# EAGLE design uv-dosimeter-guva-op-amp-mk-1.1 (EAGLE 7.5.0)
AUTHOR: sean@yak.net
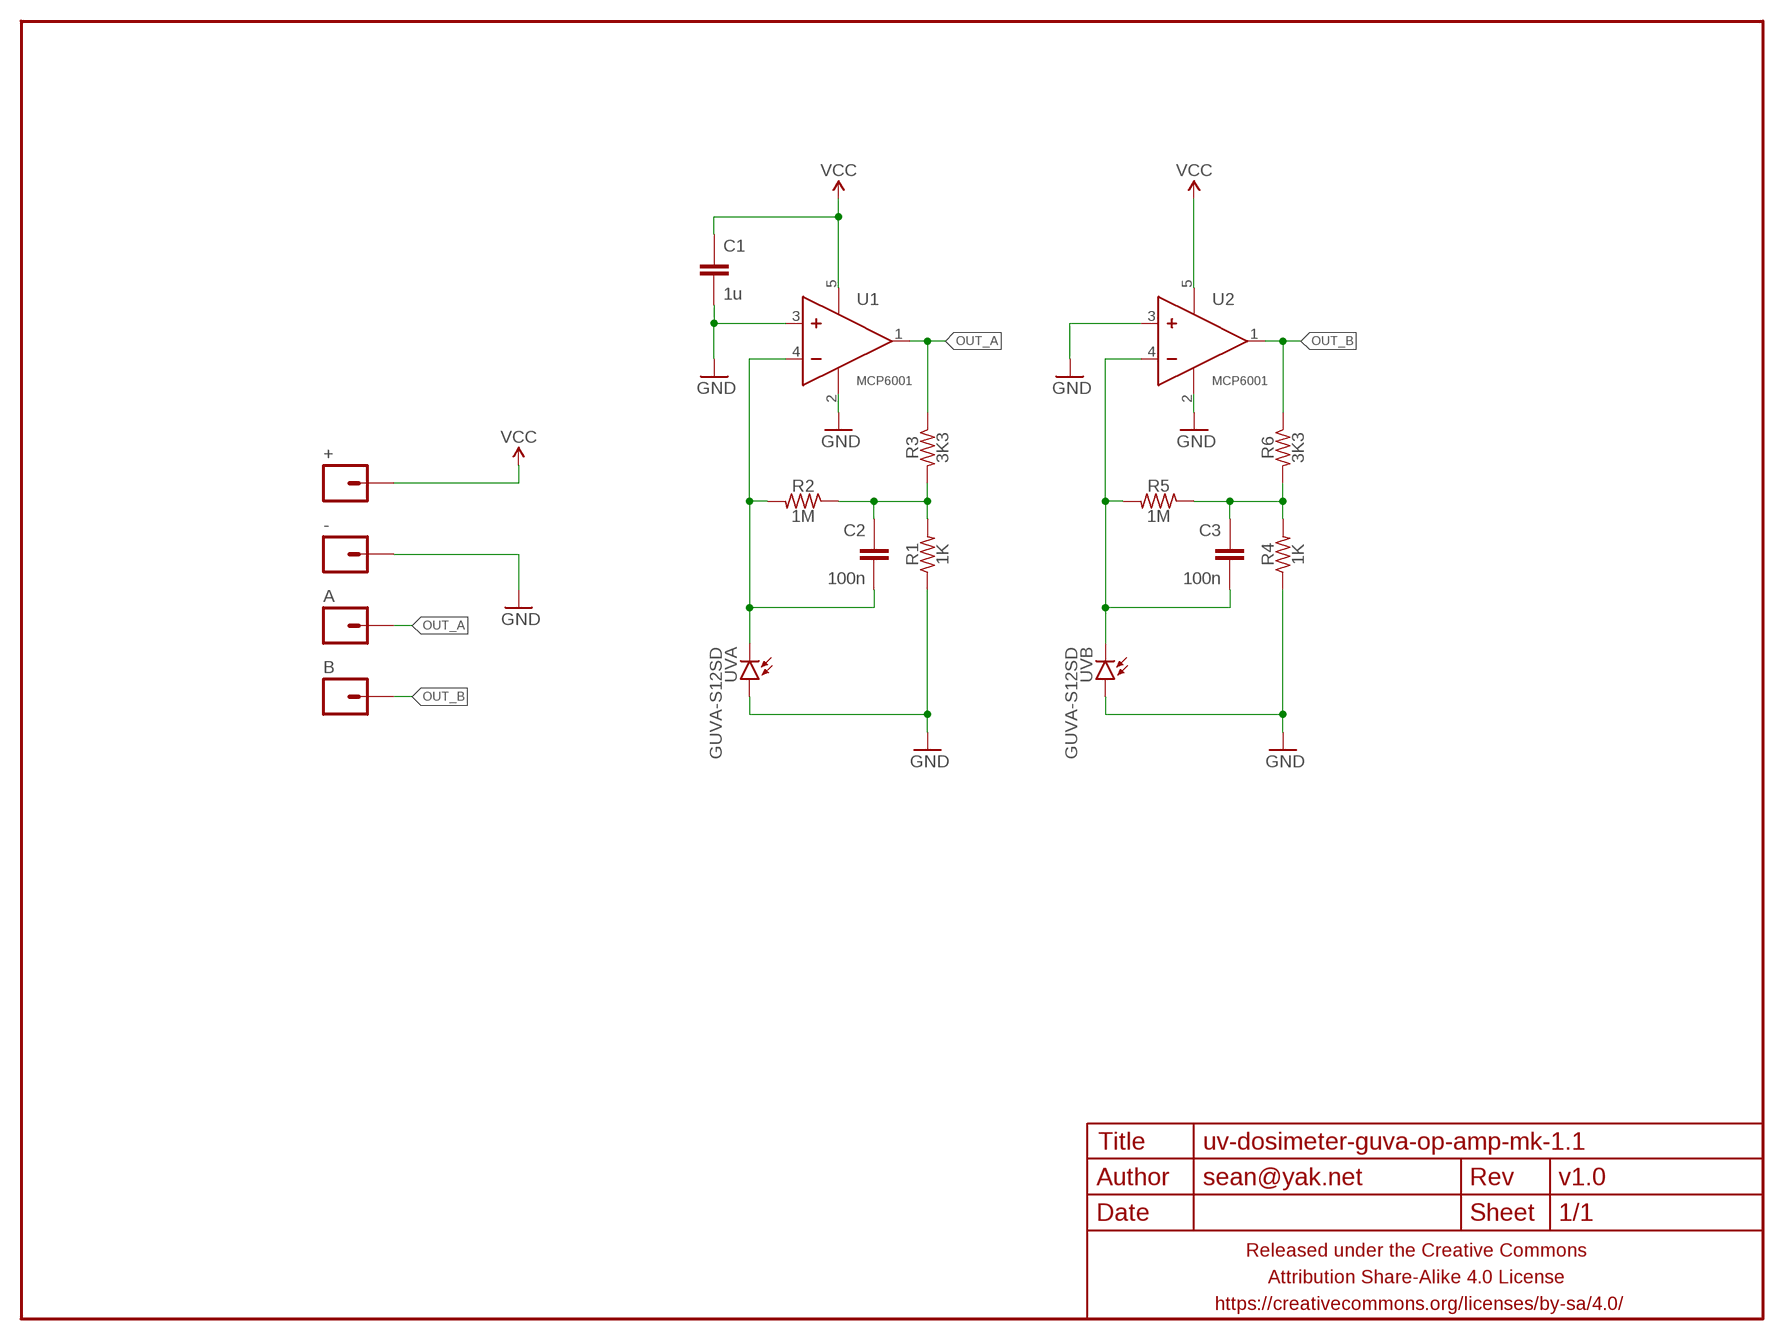
[diagram p0: schematic, sheet 1]

## Parts
+  M01PTH  [1X01]
-  M01PTH  [1X01]
A  M01PTH  [1X01]
B  M01PTH  [1X01]
C1  1u  CAPACITOR-CERAMICC0603  [C0603]
C2  100n  CAPACITOR-CERAMICC0603  [C0603]
C3  100n  CAPACITOR-CERAMICC0603  [C0603]
FRAME1  FRAME-LETTERNO_PACKAGE  [DUMMY]
R1  1K  RESISTORR0603  [R0603]
R2  1M  RESISTORR0603  [R0603]
R3  3K3  RESISTORR0603  [R0603]
R4  1K  RESISTORR0603  [R0603]
R5  1M  RESISTORR0603  [R0603]
R6  3K3  RESISTORR0603  [R0603]
U1  MCP6001  MCP6001SOT23-5  [SOT23-5]
U2  MCP6001  MCP6001SOT23-5  [SOT23-5]
UVA  GUVA-S12SD  GUVA-S12SDLED3528  [LED3528]
UVB  GUVA-S12SD  GUVA-S12SDLED3528  [LED3528]

## Nets
GND: -.1 C1.2 R1.1 R4.1 U1.2(V-) U1.3(IN+) U2.2(V-) U2.3(IN+) UVA.A UVB.A
N$2: C2.1 R1.2 R2.1 R3.2
N$4: C3.1 R4.2 R5.1 R6.2
NEG_FEED_A: C2.2 R2.2 U1.4(IN-) UVA.K(C)
NEG_FEED_B: C3.2 R5.2 U2.4(IN-) UVB.K(C)
OUT_A: A.1 R3.1 U1.1(OUT)
OUT_B: B.1 R6.1 U2.1(OUT)
VCC: +.1 C1.1 U1.5(V+) U2.5(V+)

## Library data of the parts
+ - A B = a_parts:M01: Header 1 Standard 1-pin 0.1" header. Use with straight break away headers (SKU : PRT-00116), right angle break away headers (PRT-00553), swiss pins (PRT-00743), machine pins (PRT-00117), and female headers (PRT-00115).
C1-C3 = a_parts:CAPACITOR-CERAMIC: CAPACITOR, European symbol
FRAME1 = A_butts:FRAME-LETTER: Schematic Frame Standard 8.5x11 US Letter frame; DESIGNER: sean@yak.net; VERSION: v1.0
R1-R6 = a_parts:RESISTOR: RESISTOR, American symbol
U1 U2 = a_parts:MCP6001
UVA UVB = a_parts:GUVA-S12SD

## Board
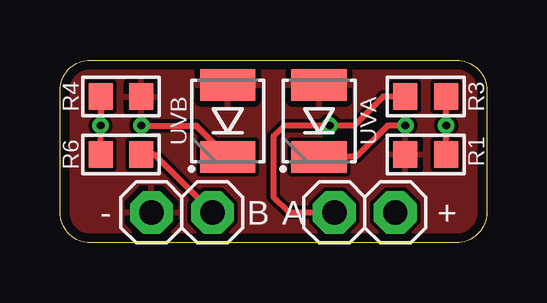
[diagram p1: board, top side]
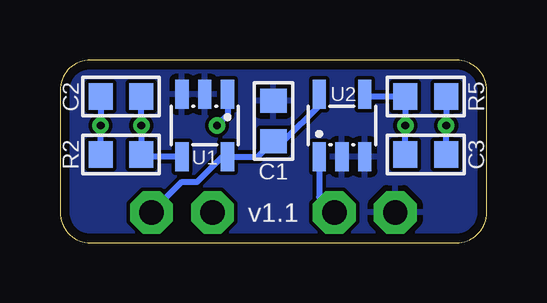
[diagram p2: board, bottom side, seen from below]

Size 17.78 x 7.62 mm. Coordinates in mm from the lower left corner, seen from the top.
Outline: 16.51,0 1.27,0 arc-90 0,1.27 0,6.35 arc-90 1.27,7.62 16.51,7.62 arc-90 17.78,6.35 17.78,1.27 arc-90 16.51,0
Copper layers (1*16): Top 0.0356mm / dielectric 1.5011mm / Bottom 0.0356mm
Design rules "LaenPCBOrder_2": minimum track width 6mil, minimum drill 13mil, track to track 6mil, track to pad 6mil, pad to pad 6mil, via to via 6mil, smd to smd 6mil, copper to edge 15mil, drill to drill 6mil, minimum pad ring 7mil, minimum via ring 7mil, stop-mask expansion 3mil, vias tented up to drill 20mil, thermal gap 10mil

### Footprints (pad centres in the part's own frame; a part is rotated, then mirrored left to right if it is on the bottom)
1X01 = drill 1.016 pad 1.778 octagon: 1 0,0
C0603 = smd 1 x 1.1: 1 -0.85,0; 2 0.85,0
R0603 = smd 1 x 1.1: 1 -0.85,0; 2 0.85,0
SOT23-5 = smd 0.55 x 1.2: 1 -0.95,-1.3; 2 0,-1.3; 3 0.95,-1.3; 4 0.95,1.3; 5 -0.95,1.3
LED3528 = smd 2.3 x 1.3: A 0,-1.5; K 0,1.5

### Placement (x,y rotation side)
+  13.97,1.27 0 top
-  3.81,1.27 0 top
A  11.43,1.27 0 top
B  6.35,1.27 0 top
C1  8.89,5.08 90 bottom
C2  15.24,6.1 0 bottom
C3  2.54,3.68 180 bottom
FRAME1  0,0 90 bottom
R1  15.24,3.68 0 top
R2  15.24,3.68 0 bottom
R3  15.24,6.1 0 top
R4  2.54,6.1 180 top
R5  2.54,6.1 180 bottom
R6  2.54,3.68 180 top
U1  11.75,4.89 180 bottom
U2  6.03,4.89 0 bottom
UVA  10.79,5.08 180 top
UVB  6.99,5.08 180 top

### Tracks (layer width: path | path; a pad name or v marks a point on that pad's centre or on a via)
GND
  pour Bottom (rank 6): 16.51,0 1.27,0 arc-90 0,1.27 0,6.35 arc-90 1.27,7.62 16.51,7.62 arc-90 17.78,6.35 17.78,1.27 arc-90
  pour Top: 16.51,0 1.27,0 arc-90 0,1.27 0,6.35 arc-90 1.27,7.62 16.51,7.62 arc-90 17.78,6.35 17.78,1.27 arc-90
N$2  (via drill 0.33)
  Top 0.254: C2.1 v16.09,4.89 R2.1
  Bottom 0.254: C2.1 v16.09,4.89 R2.1
N$4  (via drill 0.33)
  Top 0.254: 1.69,4.15 C3.1 v1.69,4.89 R5.1
  Bottom 0.254: C3.1 v1.69,4.89 R5.1
NEG_FEED_A  (via drill 0.33)
  Top 0.254: v14.39,4.89 13.65,4.89 12.34,3.58 UVA.K
  Bottom 0.254: U1.4 14.3,3.59 R2.2 v14.39,4.89 C2.2
NEG_FEED_B  (via drill 0.33)
  Top 0.254: v3.39,4.89 5.68,4.89 UVB.K
  Bottom 0.254: U2.4 4.99,6.1 R5.2 v3.39,4.89 C3.2
OUT_A  (via drill 0.33)
  Top 0.254: R3.1 13.46,6.1 12.26,4.89 v11.24,4.89 9.34,4.89 8.89,4.45 8.89,1.91 9.53,1.27 A.1
  Bottom 0.254: U1.1 10.8,5.33 v11.24,4.89
OUT_B
  Top 0.254: R6.1 3.94,3.68 B.1
  Bottom 0.254: U2.1 6.98,1.9 B.1
VCC
  Bottom 0.254: +.1 12.7,2.54 12.06,2.54 11.02,3.59 U1.5 9.53,3.59 C1.1 8.47,4.23 6.98,5.72 U2.5